# Altium schematic sheet Processor.SchDoc: Processor + JTAG
size A4; Date: 23.10.2016; Engineer: Matjaz Tome; DocumentNumber: 5; Revision: B1; SheetNumber: 5; SheetTotal: 8; Project: USB DAQ
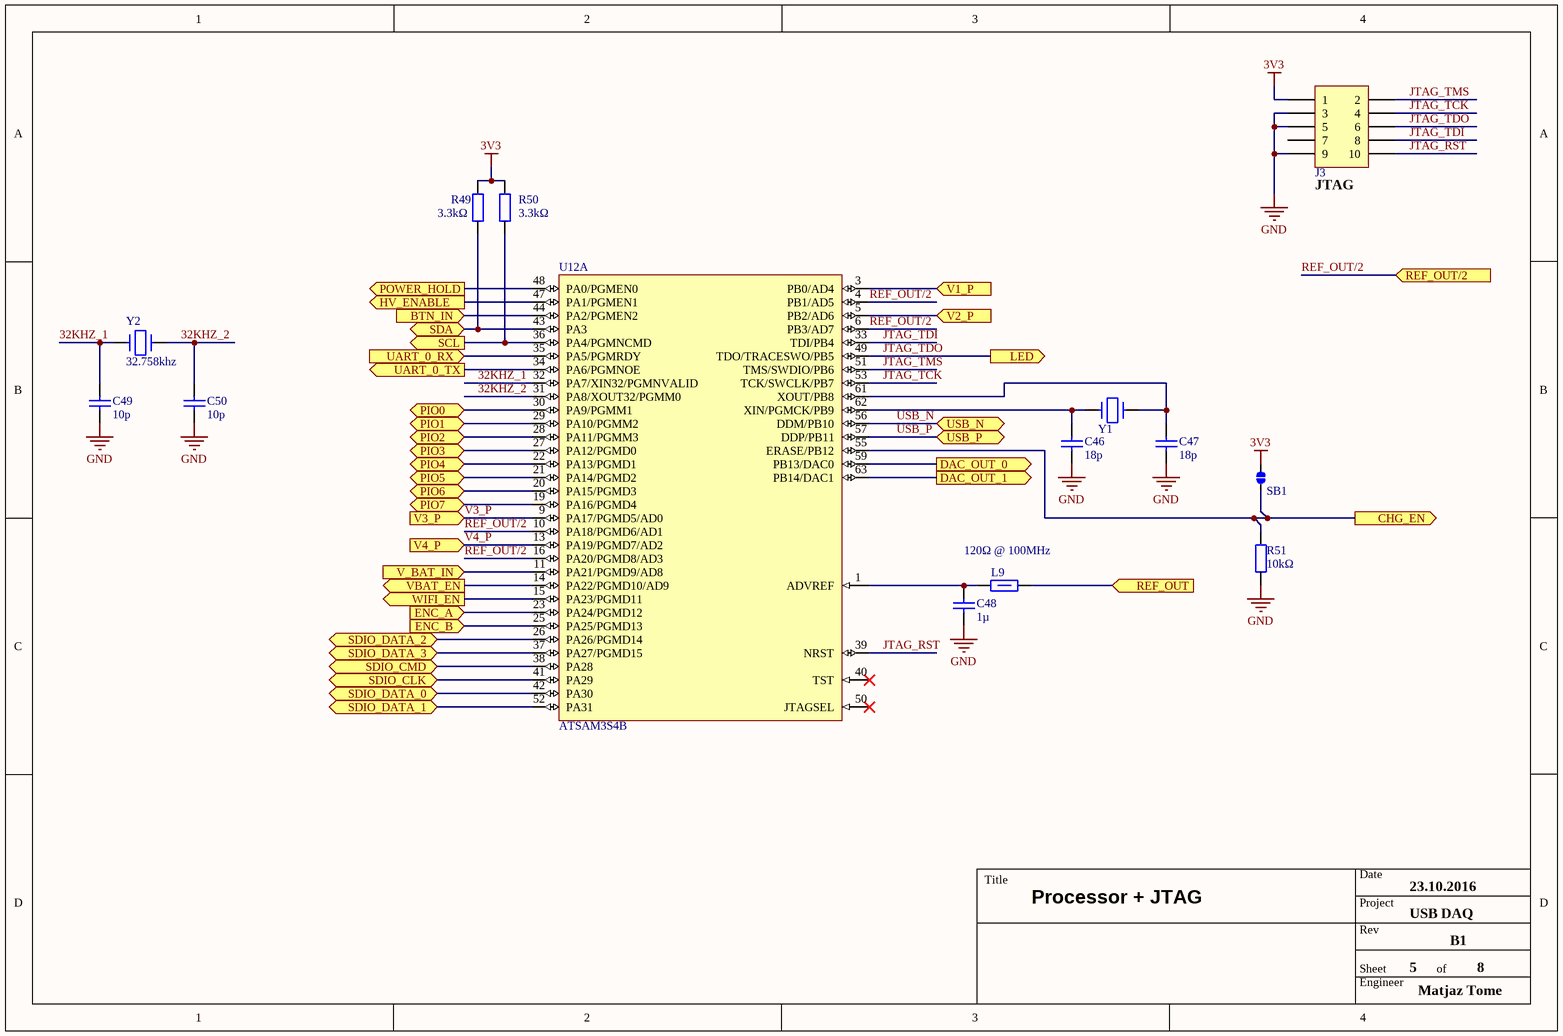
[diagram p0: Processor.SchDoc]

## Parts
C46  18p  [0603C]
C47  18p  [0603C]
C48  1µ  [0603C]
C49  10p  [0603C]
C50  10p  [0603C]
J3  (no value)  [HEADER_2X05_1.27mm]
L9  120Ω @ 100MHz  [0805R]
R49  3.3kΩ  [0603R]
R50  3.3kΩ  [0603R]
R51  10kΩ  [0603R]
SB1  Solder bridge  [SB1]  (value not drawn)  (no BOM)
U12  ATSAM3S4B  [LQFP64]  (part A of 2)
Y1  16MHz  [5X3.2]  (value not drawn)
Y2  32.758khz  [2X6_FLAT]

## Ports
BTN_IN (in), CHG_EN (out), DAC_OUT_0 (out), DAC_OUT_1 (out), ENC_A (in), ENC_B (in), HV_ENABLE (out), LED (out), PIO0 (bidir), PIO1 (bidir), PIO2 (bidir), PIO3 (bidir), PIO4 (bidir), PIO5 (bidir), PIO6 (bidir), PIO7 (bidir), POWER_HOLD (out), REF_OUT (in), REF_OUT/2 (in), SCL (out), SDA (bidir), SDIO_CLK (bidir), SDIO_CMD (bidir), SDIO_DATA_0 (bidir), SDIO_DATA_1 (bidir), SDIO_DATA_2 (bidir), SDIO_DATA_3 (bidir), UART_0_RX (in), UART_0_TX (out), USB_N (bidir), USB_P (bidir), V1_P (in), V2_P (in), V3_P (in), V4_P (in), V_BAT_IN (in), VBAT_EN (out), WIFI_EN (out)

## Nets
3V3: J3.1 R49.2 R50.2 SB1.2
GND: C46.1 C47.1 C48.1 C49.1 C50.1 J3.3 J3.5 J3.9 R51.1
32KHZ_1: C49.2 U12.32(PA7/XIN32/PGMNVALID) Y2.2
32KHZ_2: C50.2 U12.31(PA8/XOUT32/PGMM0) Y2.1
BTN_IN: U12.44(PA2/PGMEN2) ; port BTN_IN
CHG_EN: R51.2 SB1.1 U12.55(ERASE/PB12) ; port CHG_EN
DAC_OUT_0: U12.59(PB13/DAC0) ; port DAC_OUT_0
DAC_OUT_1: U12.63(PB14/DAC1) ; port DAC_OUT_1
ENC_A: U12.23(PA24/PGMD12) ; port ENC_A
ENC_B: U12.25(PA25/PGMD13) ; port ENC_B
HV_ENABLE: U12.47(PA1/PGMEN1) ; port HV_ENABLE
JTAG_RST: J3.10 U12.39(NRST)
JTAG_TCK: J3.4 U12.53(TCK/SWCLK/PB7)
JTAG_TDI: J3.8 U12.33(TDI/PB4)
JTAG_TDO: J3.6 U12.49(TDO/TRACESWO/PB5) ; port LED
JTAG_TMS: J3.2 U12.51(TMS/SWDIO/PB6)
PIO0: U12.30(PA9/PGMM1) ; port PIO0
PIO1: U12.29(PA10/PGMM2) ; port PIO1
PIO2: U12.28(PA11/PGMM3) ; port PIO2
PIO3: U12.27(PA12/PGMD0) ; port PIO3
PIO4: U12.22(PA13/PGMD1) ; port PIO4
PIO5: U12.21(PA14/PGMD2) ; port PIO5
PIO6: U12.20(PA15/PGMD3) ; port PIO6
PIO7: U12.19(PA16/PGMD4) ; port PIO7
POWER_HOLD: U12.48(PA0/PGMEN0) ; port POWER_HOLD
REF_OUT: L9.2 ; port REF_OUT
REF_OUT/2: U12.4(PB1/AD5) U12.6(PB3/AD7) U12.10(PA18/PGMD6/AD1) U12.16(PA20/PGMD8/AD3) ; port REF_OUT/2
SCL: R50.1 U12.36(PA4/PGMNCMD) ; port SCL
SDA: R49.1 U12.43(PA3) ; port SDA
SDIO_CLK: U12.41(PA29) ; port SDIO_CLK
SDIO_CMD: U12.38(PA28) ; port SDIO_CMD
SDIO_DATA_0: U12.42(PA30) ; port SDIO_DATA_0
SDIO_DATA_1: U12.52(PA31) ; port SDIO_DATA_1
SDIO_DATA_2: U12.26(PA26/PGMD14) ; port SDIO_DATA_2
SDIO_DATA_3: U12.37(PA27/PGMD15) ; port SDIO_DATA_3
UART_0_RX: U12.35(PA5/PGMRDY) ; port UART_0_RX
UART_0_TX: U12.34(PA6/PGMNOE) ; port UART_0_TX
USB_N: U12.56(DDM/PB10) ; port USB_N
USB_P: U12.57(DDP/PB11) ; port USB_P
V1_P: U12.3(PB0/AD4) ; port V1_P
V2_P: U12.5(PB2/AD6) ; port V2_P
V3_P: U12.9(PA17/PGMD5/AD0) ; port V3_P
V4_P: U12.13(PA19/PGMD7/AD2) ; port V4_P
V_BAT_IN: U12.11(PA21/PGMD9/AD8) ; port V_BAT_IN
VBAT_EN: U12.14(PA22/PGMD10/AD9) ; port VBAT_EN
WIFI_EN: U12.15(PA23/PGMD11) ; port WIFI_EN
NetC46_2: C46.2 U12.62(XIN/PGMCK/PB9) Y1.1
NetC47_2: C47.2 U12.61(XOUT/PB8) Y1.2
NetC48_2: C48.2 L9.1 U12.1(ADVREF)

Not connected (* = marked no-connect by the designer): J3 7; U12 40(TST)* 50(JTAGSEL)*

## Notes on the sheet
- (near J3) JTAG
- Title
- Date
- Project
- Rev
- Engineer
- Sheet
- of

## Library data of the parts
C46 C47 = GSC0017: ceramic C0G SMD capacitor smd 0603 18pF 100V; Manufacturer: Kemet; Manufacturer Number: C0603C180J1GACTU; Dealer number: 1813428; Dealer: Farnell; Tolerance: 5%; Part Number: GSC0017; Category: capacitors; Price: 0.15; Value: 18pF; Voltage: 100V; Case: 0603; Technology: SMT; Dielectric: C0G; HelpURL: U:\datasheet\cap\KEMET C0G SMD.pdf; SKU: 1020000000003; Supplier 1: Farnell; Supplier part number 1: 1813428
C48 = ZSC0003: ceramic X5R SMD capacitor smd 0603 1µF 50V; Manufacturer: Murata; Manufacturer Number: GRM188R61H105KAALD; Tolerance: 10%; Part Number: ZSC0003; Category: capacitors; Price: 0.144; Value: 1µF; Voltage: 50V; Case: 0603; Technology: SMT; Dielectric: X5R; HelpURL: U:\datasheet\cap\Murata\GRM\GRM188R61H105KAALD.pdf; SKU: 1020300000001; Supplier part number 1: 1845736; Supplier 1: Farnell
C49 C50 = GSC0019: ceramic C0G SMD capacitor smd 0603 10pF 100V; Manufacturer: Kemet; Manufacturer Number: C0603C100J1GACTU; Dealer number: 1414600; Dealer: Farnell; Tolerance: 5%; Part Number: GSC0019; Category: capacitors; Price: 0.038; Value: 10pF; Voltage: 100V; Case: 0603; Technology: SMT; Dielectric: C0G; HelpURL: U:\datasheet\cap\KEMET C0G SMD.pdf; SKU: 1020000000004; Supplier 1: Farnell; Supplier part number 1: 1414600
J3 = XCH0006: Header strait 1.27mm 5way X 2; Manufacturer: Harwin; Manufacturer Number: M50-3600542; Gender: Male; Rows: 2; Part Number: XCH0006; Category: Connectors; Price: 0.90; Pins: 5; Pitch: 1.27mm; Orientation: strait; Technology: SMD; Supplier part number 1: 1022310; Supplier 1: Farnell
L9 = XFB0000: Ferrite bead, 0.15Ω, 200mA, 0805, 120E @ 100MHz; Manufacturer: Murata; Manufacturer Number: BLM21AG121SN1D; Dealer number: 1515617; Dealer: Farnell; Max current: 0.2A; Part Number: XFB0000; Category: ferite beads; Price: 0.082; DC resistance: 0.15Ω; AC resistance: 120Ω; Frequency: 100MHz; Case: 0805; Technology: SMT; HelpURL: U:\datasheet\ferrite_beads\BLM21A.pdf; Supplier 1: Farnell; Supplier part number 1: 1515617
R49 R50 = XRS0055: resistor smd 0603 3.3kΩ 5% 0.1w; Manufacturer: Yageo; Manufacturer Number: RC0603JR-073K3L; Temperature coefficient: 100ppm; Part Number: XRS0055; Category: resistors; Supplier part number 1: 9233440; Supplier 1: Farnell; Price: 0.0118; Value: 3.3kΩ; Power: 0.1W; Tolerance: 5%; Case: 0603; Technology: SMT; Material: Metal film / Metal film; HelpURL: U:\datasheet\res\YAGEO_2.pdf
R51 = YRS0016: resistor smd 0603 10kΩ 1% 0.1w; Manufacturer: Vishay; Manufacturer Number: CRCW060310K0FKEA; Dealer number: 1469748; Dealer: Farnell; Temperature coefficient: 100ppm; Part Number: YRS0016; Category: resistors; Price: 0.0143€; Value: 10kΩ; Power: 0.1W; Tolerance: 1%; Case: 0603; Technology: SMT; Material: Metal film - thick / Metal film; HelpURL: U:\datasheet\res\VISHAY CRCW0603.pdf; SKU: 1000000000002; Supplier 1: Farnell; Supplier part number 1: 1469748
SB1 = XXC0005: Solder bridge 1mm by 2mm; Part Number: XXC0005; Category: Solder bridge
U12 = XAM0003: Cortex M3 ARM microcontroller; Manufacturer: Atmel; Manufacturer Number: ATSAM3S4BA-AU; Dealer number: 1841656; Dealer: Farnell; Core: Cortex-M3; Supply voltage max: 3.6V; Supply voltage min: 1.62V; Flash: 256kB; RAM: 48kB; GPIOs: 47; Timers: 3; ADCs: 8; SPI: 1; IIC: 2; Max Frequency: 64MHz; Part Number: XAM0003; Category: Integrated circuits; Price: 6.58; UART: 3; Case: LQFP64; Technology: SMT; HelpURL: U:\datasheet\microcontrollers\arm\SAM3SXA.pdf; Temperature range: -40°C to +85°C; Supplier 1: Farnell; Supplier part number 1: 1841656
Y1 = XCR0007: Crystal 16Mhz; Manufacturer: TCX; Manufacturer Number: 7A-16.000MAAJ-T; Load capacitance: 18pF; Frequency tolerance: 30ppm; Part Number: XCR0007; Category: Crystals; Price: 0.91; Value: 16MHz; Technology: SMT; Case: 5X3.2; HelpURL: U:\datasheet\crystals\TXC_7A.pdf; Supplier part number 1: 1841946; Supplier 1: Farnell
Y2 = XCR0010: Crystal 32.768khz; Manufacturer: RALTRON; Manufacturer Number: R26-32.768- 12.5; Load capacitance: 12pF; Frequency tolerance: 20ppm; Part Number: XCR0010; Category: Crystals; Price: 0.18; Value: 32.758khz; Technology: THT; Case: 5X3.2_1; HelpURL: U:\datasheet\crystals\raltron.pdf; Supplier part number 1: 1652573; Supplier 1: Farnell